# EAGLE design LilyPad-MP3-v15a (EAGLE 6.4)

## Sheet 1 of 2
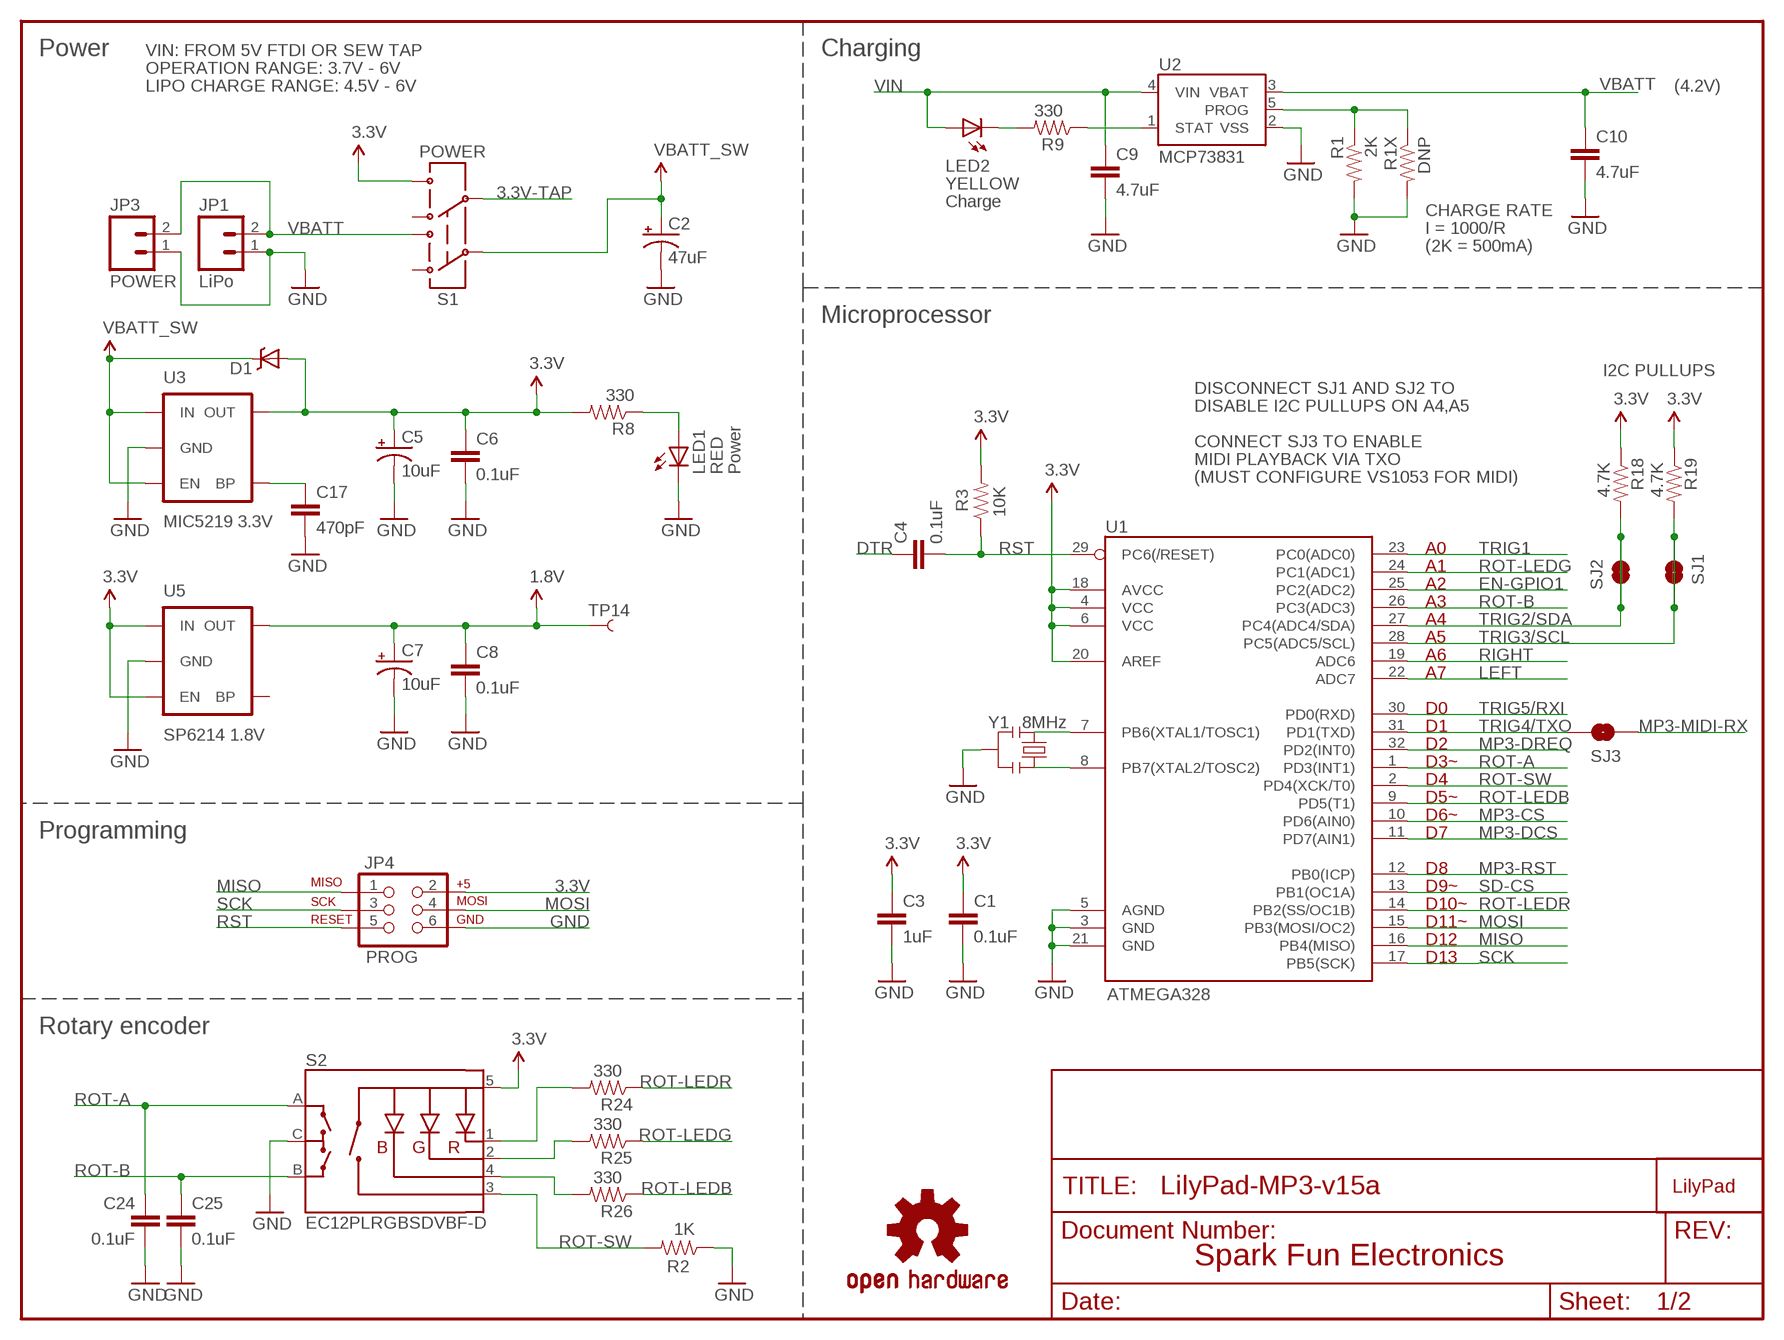
[diagram p0: schematic, sheet 1]

### Parts
C1  0.1uF  CAP0402-CAP  [0402-CAP]
C2  47uF  CAP_POL3528  [EIA3528]
C3  1uF  CAP0402-CAP  [0402-CAP]
C4  0.1uF  CAP0402-CAP  [0402-CAP]
C5  10uF  CAP_POL1206  [EIA3216]
C6  0.1uF  CAP0402-CAP  [0402-CAP]
C7  10uF  CAP_POL1206  [EIA3216]
C8  0.1uF  CAP0402-CAP  [0402-CAP]
C9  4.7uF  CAP0402-CAP  [0402-CAP]
C10  4.7uF  CAP0402-CAP  [0402-CAP]
C17  470pF  CAP0402-CAP  [0402-CAP]
C24  0.1uF  CAP0402-CAP  [0402-CAP]
C25  0.1uF  CAP0402-CAP  [0402-CAP]
D1  DIODE-SCHOTTKY  [SOD-523]
JP1  LiPo  M02-JST-2MM-SMT  [JST-2-SMD]
JP3  POWER  M02PTH  [1X02]
JP4  PROG  AVR_SPI_PRG_6NS  [2X3-NS]
LED1  RED  LED0603  [LED-0603]
LED2  YELLOW  LED0603  [LED-0603]
R1  2K  RESISTOR0402-RES  [0402-RES]
R1X  DNP  RESISTORAXIAL-0.3  [AXIAL-0.3]
R2  1K  RESISTOR0402-RES  [0402-RES]
R3  10K  RESISTOR0402-RES  [0402-RES]
R8  330  RESISTOR0402-RES  [0402-RES]
R9  330  RESISTOR0402-RES  [0402-RES]
R18  4.7K  RESISTOR0402-RES  [0402-RES]
R19  4.7K  RESISTOR0402-RES  [0402-RES]
R24  330  RESISTOR0402-RES  [0402-RES]
R25  330  RESISTOR0402-RES  [0402-RES]
R26  330  RESISTOR0402-RES  [0402-RES]
S1  POWER  AYZ0202  [AYZ0202]
S2  EC12PLRGBSDVBF-D  ENCODER_3LED_CA  [ENCODER_LED_3]
SJ1  SOLDERJUMPERNO  [SJ_2S-NO]
SJ2  SOLDERJUMPERNO  [SJ_2S-NO]
SJ3  SOLDERJUMPERNO  [SJ_2S-NO]
TP14  1.8V  TEST-POINT3X5  [PAD.03X.05]
U1  ATMEGA328  ATMEGA168  [TQFP32-08]
U2  MCP73831  [SOT23-5]
U3  MIC5219 3.3V  V_REG_LDOSMD  [SOT23-5]
U5  SP6214 1.8V  V_REG_LDOSMD2  [SC70]
U$1  LOGO-LPLP  [LOGO-LILYPAD]
U$4  OSHW-LOGOM  [OSHW-LOGO-M]
Y1  8MHz  RESONATORSMD  [RESONATOR-SMD]

### Nets
1.8V: C7.A(+) C8.1 TP14.P$1 U5.5(OUT) ; also sheet 2
3.3V: C1.1 C3.1 C5.A(+) C6.1 D1.A JP4.2 R3.2 R8.2 R18.1 R19.1 S1.4 S2.5(+) U1.4(VCC) U1.6(VCC) U1.18(AVCC) U1.20(AREF) U3.5(OUT) U5.1(IN) U5.3(EN) ; also sheet 2
3.3V-TAP: S1.5 ; also sheet 2
DTR: C4.1 ; also sheet 2
EN-GPIO1: U1.25(PC2(ADC2)) ; also sheet 2
GND [VCC]: C1.2 C2.C(-) C3.2 C5.C(-) C6.2 C7.C(-) C8.2 C9.2 C10.2 C17.2 C24.2 C25.2 JP1.1 JP3.1 JP4.6 LED1.C R1.2 R1X.P$2 R2.1 S2.C U1.3(GND) U1.5(AGND) U1.21(GND) U2.2(VSS) U3.2(GND) U5.2(GND) Y1.2 ; also sheet 2
LEFT: U1.22(ADC7) ; also sheet 2
MISO: JP4.1 U1.16(PB4(MISO)) ; also sheet 2
MOSI: JP4.4 U1.15(PB3(MOSI/OC2)) ; also sheet 2
MP3-CS: U1.10(PD6(AIN0)) ; also sheet 2
MP3-DCS: U1.11(PD7(AIN1)) ; also sheet 2
MP3-DREQ: U1.32(PD2(INT0)) ; also sheet 2
MP3-MIDI-RX: SJ3.1 ; also sheet 2
MP3-RST: U1.12(PB0(ICP)) ; also sheet 2
N$1: U1.7(PB6(XTAL1/TOSC1)) Y1.1
N$3: U1.8(PB7(XTAL2/TOSC2)) Y1.3
N$6: LED1.A R8.1
N$8: LED2.C R9.2
N$12: R24.2 S2.1(-R)
N$13: R25.2 S2.2(-G)
N$14: R26.2 S2.4(-B)
N$70: C17.1 U3.4(BP)
PROG: R1.1 R1X.P$1 U2.5(PROG)
RIGHT: U1.19(ADC6) ; also sheet 2
ROT-A: C24.1 S2.A U1.1(PD3(INT1))
ROT-B: C25.1 S2.B U1.26(PC3(ADC3))
ROT-LEDB: R26.1 U1.9(PD5(T1))
ROT-LEDG: R25.1 U1.24(PC1(ADC1))
ROT-LEDR: R24.1 U1.14(PB2(SS/OC1B))
ROT-SW: R2.2 S2.3(SW) U1.2(PD4(XCK/T0))
RST: C4.2 JP4.5 R3.1 U1.29(PC6(/RESET))
SCK: JP4.3 U1.17(PB5(SCK)) ; also sheet 2
SD-CS: U1.13(PB1(OC1A)) ; also sheet 2
STAT: R9.1 U2.1(STAT)
TRIG1: U1.23(PC0(ADC0)) ; also sheet 2
TRIG2/SDA: R18.2 SJ2.1 SJ2.2 U1.27(PC4(ADC4/SDA)) ; also sheet 2
TRIG3/SCL: R19.2 SJ1.1 SJ1.2 U1.28(PC5(ADC5/SCL)) ; also sheet 2
TRIG4/TXO: SJ3.2 U1.31(PD1(TXD)) ; also sheet 2
TRIG5/RXI: U1.30(PD0(RXD)) ; also sheet 2
VBATT: C10.1 JP1.2 JP3.2 S1.1 U2.3(VBAT)
VBATT_SW: C2.A(+) D1.C S1.2 U3.1(IN) U3.3(EN) ; also sheet 2
VIN: C9.1 LED2.A U2.4(VIN) ; also sheet 2
Unconnected: S1.3 S1.6 U5.4(BP)

### Notes on the sheet
- Power | VIN: FROM 5V FTDI OR SEW TAP | Charging
- OPERATION RANGE: 3.7V - 6V
- LIPO CHARGE RANGE: 4.5V - 6V | (4.2V)
- Charge
- CHARGE RATE
- I = 1000/R
- (2K = 500mA)
- Microprocessor
- I2C PULLUPS
- DISCONNECT SJ1 AND SJ2 TO
- DISABLE I2C PULLUPS ON A4,A5
- CONNECT SJ3 TO ENABLE
- MIDI PLAYBACK VIA TXO
- Power
- (MUST CONFIGURE VS1053 FOR MIDI)
- A0
- A1
- A2
- A3
- A4
- A5
- A6
- A7
- D0
- D1
- D2
- D3~
- D4
- D5~
- D6~
- Programming | D7
- D8
- D9~
- D10~
- D11~
- D12
- D13
- Rotary encoder
- Spark Fun Electronics

## Sheet 2 of 2
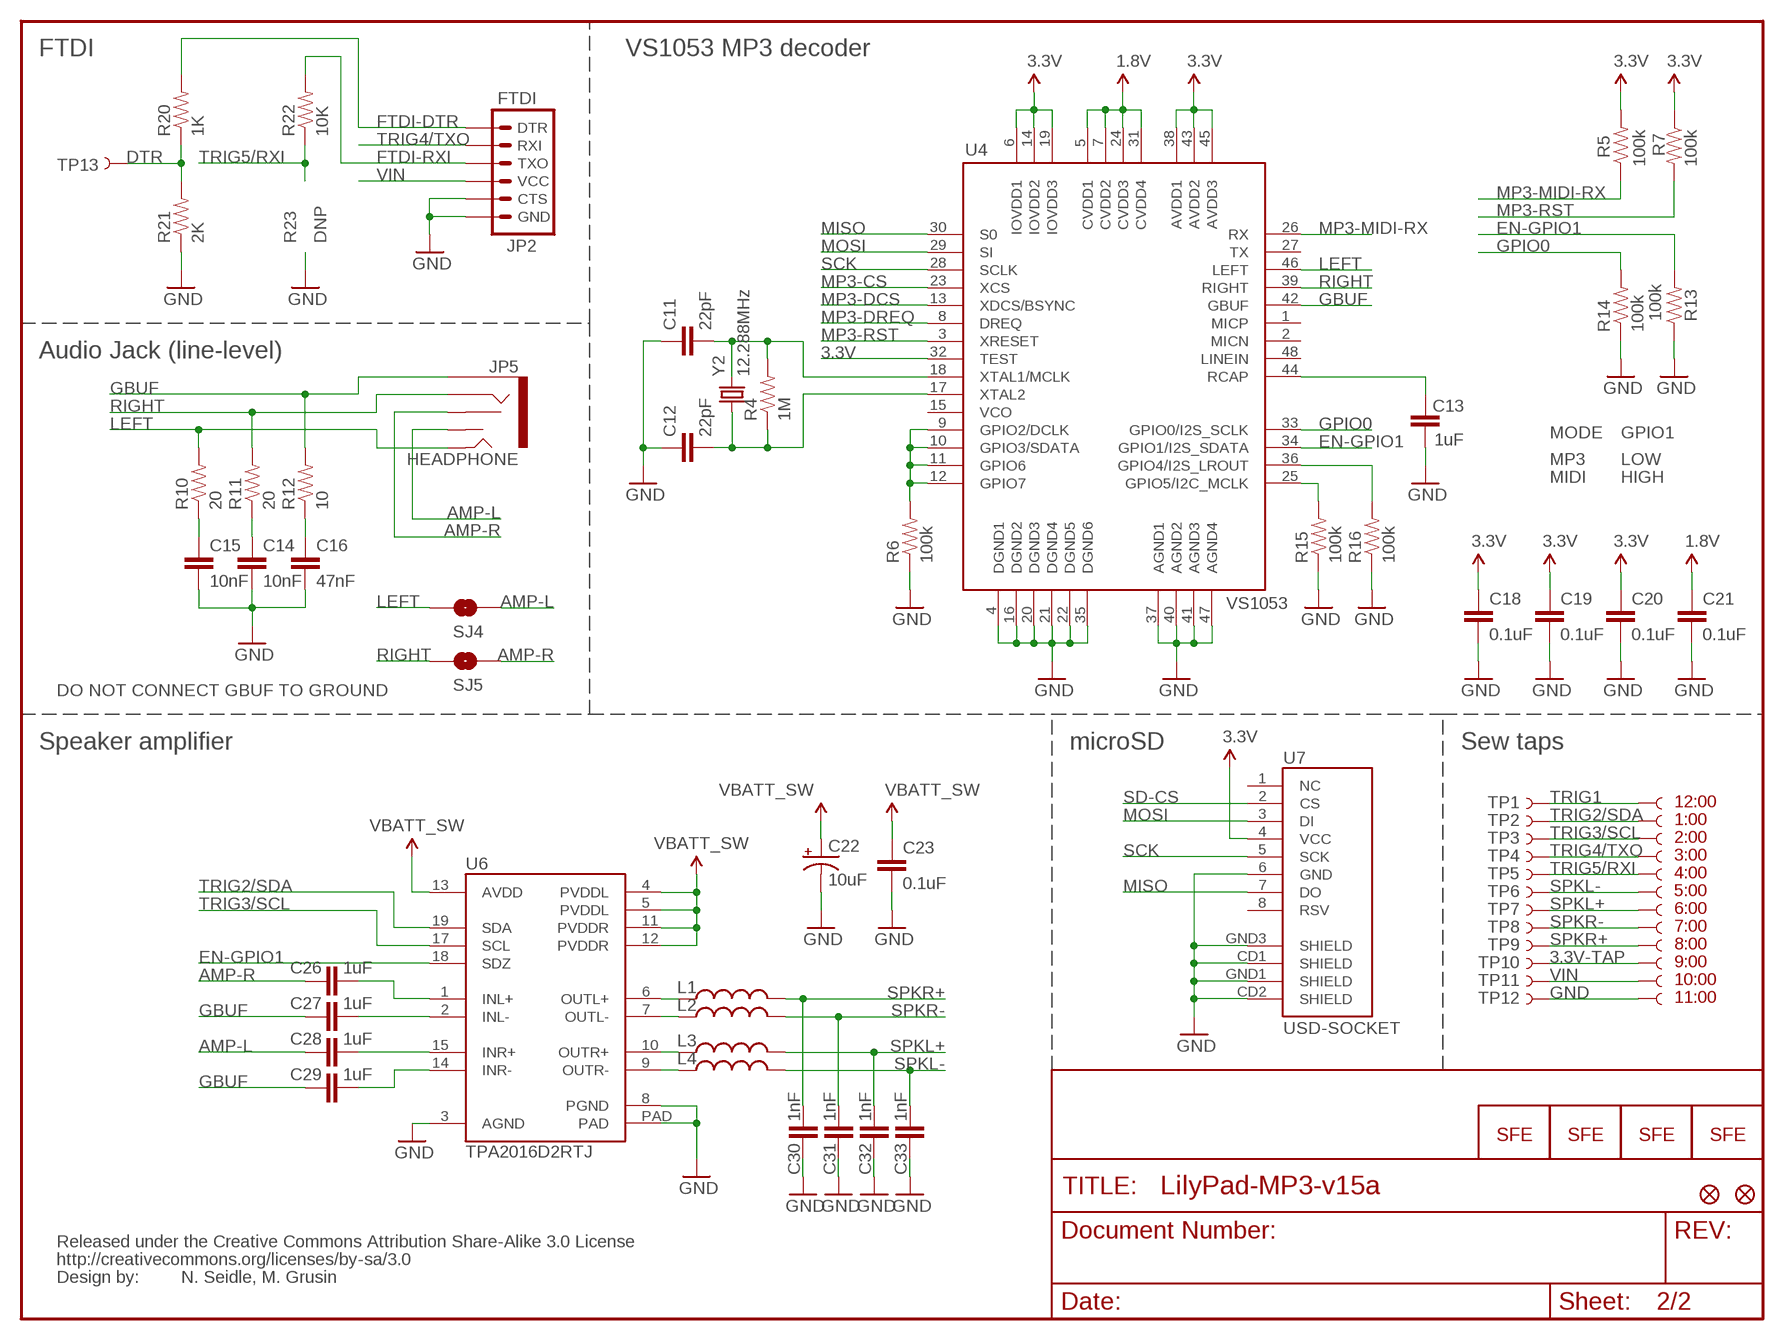
[diagram p1: schematic, sheet 2]

### Parts
C11  22pF  CAP0402-CAP  [0402-CAP]
C12  22pF  CAP0402-CAP  [0402-CAP]
C13  1uF  CAP0402-CAP  [0402-CAP]
C14  10nF  CAP0402-CAP  [0402-CAP]
C15  10nF  CAP0402-CAP  [0402-CAP]
C16  47nF  CAP0402-CAP  [0402-CAP]
C18  0.1uF  CAP0402-CAP  [0402-CAP]
C19  0.1uF  CAP0402-CAP  [0402-CAP]
C20  0.1uF  CAP0402-CAP  [0402-CAP]
C21  0.1uF  CAP0402-CAP  [0402-CAP]
C22  10uF  CAP_POL1206  [EIA3216]
C23  0.1uF  CAP0402-CAP  [0402-CAP]
C26  1uF  CAP0402-CAP  [0402-CAP]
C27  1uF  CAP0402-CAP  [0402-CAP]
C28  1uF  CAP0402-CAP  [0402-CAP]
C29  1uF  CAP0402-CAP  [0402-CAP]
C30  1nF  CAP0402-CAP  [0402-CAP]
C31  1nF  CAP0402-CAP  [0402-CAP]
C32  1nF  CAP0402-CAP  [0402-CAP]
C33  1nF  CAP0402-CAP  [0402-CAP]
JP2  FTDI  ARDUINO_SERIAL_PROGRAMSMD  [1X06-SMD]
JP5  HEADPHONE  AUDIO-JACK2SMD  [AUDIO-JACK-3.5MM-SMD]
JP6  LOGO-SFENW2  [SFE-NEW-WEB]
JP7  FIDUCIALUFIDUCIAL  [MICRO-FIDUCIAL]
JP8  FIDUCIALUFIDUCIAL  [MICRO-FIDUCIAL]
L1  INDUCTOR0805  [0805]
L2  INDUCTOR0805  [0805]
L3  INDUCTOR0805  [0805]
L4  INDUCTOR0805  [0805]
LOGO1  LOGO-SFESK  [SFE-LOGO-FLAME]
LOGO2  LOGO-SFENEW  [SFE-NEW-WEBLOGO]
LOGO3  LOGO-SFESK  [SFE-LOGO-FLAME]
R4  1M  RESISTOR0402-RES  [0402-RES]
R5  100k  RESISTOR0402-RES  [0402-RES]
R6  100k  RESISTOR0402-RES  [0402-RES]
R7  100k  RESISTOR0402-RES  [0402-RES]
R10  20  RESISTOR0402-RES  [0402-RES]
R11  20  RESISTOR0402-RES  [0402-RES]
R12  10  RESISTOR0402-RES  [0402-RES]
R13  100k  RESISTOR0402-RES  [0402-RES]
R14  100k  RESISTOR0402-RES  [0402-RES]
R15  100k  RESISTOR0402-RES  [0402-RES]
R16  100k  RESISTOR0402-RES  [0402-RES]
R20  1K  RESISTOR0402-RES  [0402-RES]
R21  2K  RESISTOR0402-RES  [0402-RES]
R22  10K  RESISTOR0402-RES  [0402-RES]
SJ4  SOLDERJUMPERNO  [SJ_2S-NO]
SJ5  SOLDERJUMPERNO  [SJ_2S-NO]
ST1  TRIG2/SDA  SEWTAP9  [PETAL-LONG-1-2SIDE]
ST2  TRIG3/SCL  SEWTAP9  [PETAL-LONG-1-2SIDE]
ST3  TRIG4/TXO  SEWTAP9  [PETAL-LONG-1-2SIDE]
ST4  TRIG5/RXI  SEWTAP9  [PETAL-LONG-1-2SIDE]
ST5  SPKL-  SEWTAP9  [PETAL-LONG-1-2SIDE]
ST6  SPKL+  SEWTAP9  [PETAL-LONG-1-2SIDE]
ST7  SPKR-  SEWTAP9  [PETAL-LONG-1-2SIDE]
ST8  SPKR+  SEWTAP9  [PETAL-LONG-1-2SIDE]
ST9  3.3V  SEWTAP9  [PETAL-LONG-1-2SIDE]
ST10  VIN  SEWTAP9  [PETAL-LONG-1-2SIDE]
ST11  GND  SEWTAP9  [PETAL-LONG-1-2SIDE]
ST12  TRIG1  SEWTAP9  [PETAL-LONG-1-2SIDE]
TP1  TRIG1  TEST-POINT-PTH-LARGE  [1X01NS]
TP2  TRIG2/SDA  TEST-POINT-PTH-LARGE  [1X01NS]
TP3  TRIG3/SCL  TEST-POINT-PTH-LARGE  [1X01NS]
TP4  TRIG4/TXO  TEST-POINT-PTH-LARGE  [1X01NS]
TP5  TRIG5/RXI  TEST-POINT-PTH-LARGE  [1X01NS]
TP6  SPKL-  TEST-POINT-PTH-LARGE  [1X01NS]
TP7  SPKL+  TEST-POINT-PTH-LARGE  [1X01NS]
TP8  SPKR-  TEST-POINT-PTH-LARGE  [1X01NS]
TP9  SPKR+  TEST-POINT-PTH-LARGE  [1X01NS]
TP10  3.3V  TEST-POINT-PTH-LARGE  [1X01NS]
TP11  VIN  TEST-POINT-PTH-LARGE  [1X01NS]
TP12  GND  TEST-POINT-PTH-LARGE  [1X01NS]
TP13  DTR  TEST-POINT3X5  [PAD.03X.05]
U4  VS1053  VS1033  [LQFP-48]
U6  TPA2016D2RTJ  [QFN-20-0.5MM]
U7  USD-SOCKET  USD-SOCKETNEW  [MICRO-SD-SOCKET-PP]
U$12  CREATIVE_COMMONS  [CREATIVE_COMMONS]
Y2  12.288MHz  CRYSTAL5X3  [CRYSTAL-SMD-5X3]

### Nets
1.8V: C21.1 U4.5(CVDD1) U4.7(CVDD2) U4.24(CVDD3) U4.31(CVDD4) ; also sheet 1
3.3V: C18.1 C19.1 C20.1 R5.2 R7.1 U4.6(IOVDD1) U4.14(IOVDD2) U4.19(IOVDD3) U4.32(TEST) U4.38(AVDD1) U4.43(AVDD2) U4.45(AVDD3) U7.4(VCC) ; also sheet 1
3.3V-TAP: ST9.1 TP10.1 ; also sheet 1
AMP-L: C28.1 JP5.TSH SJ4.1
AMP-LX: C26.2 U6.1(INL+)
AMP-R: C26.1 JP5.RSH SJ5.1
AMP-RX: C28.2 U6.15(INR+)
DTR: R20.1 R21.2 TP13.P$1 ; also sheet 1
EN-GPIO1: R13.2 U4.34(GPIO1/I2S_SDATA) U6.18(SDZ) ; also sheet 1
FTDI-DTR: JP2.1(DTR) R20.2
FTDI-RXI: JP2.3(TXO) R22.2
G1: R6.2 U4.9(GPIO2/DCLK) U4.10(GPIO3/SDATA) U4.11(GPIO6) U4.12(GPIO7)
G2: R15.2 U4.25(GPIO5/I2C_MCLK)
GBUF: C27.1 C29.1 JP5.SLEEVE R12.2 U4.42(GBUF)
GBUFLX: C27.2 U6.2(INL-)
GBUFRX: C29.2 U6.14(INR-)
GND [VCC]: C11.1 C12.1 C13.1 C14.2 C15.2 C16.2 C18.2 C19.2 C20.2 C21.2 C22.C(-) C23.2 C30.2 C31.2 C32.2 C33.2 JP2.5(CTS) JP2.6(GND) R6.1 R13.1 R14.1 R15.1 R16.1 R21.1 ST11.1 TP12.1 U4.4(DGND1) U4.16(DGND2) U4.20(DGND3) U4.21(DGND4) U4.22(DGND5) U4.35(DGND6) U4.37(AGND1) U4.40(AGND2) U4.41(AGND3) U4.47(AGND4) U6.3(AGND) U6.8(PGND) U6.PAD U7.6(GND) U7.CD1(SHIELD) U7.CD2(SHIELD) U7.GND1(SHIELD) U7.GND3(SHIELD) ; also sheet 1
GPIO0: R14.2 U4.33(GPIO0/I2S_SCLK)
LEFT: JP5.TIP R10.2 SJ4.2 U4.46(LEFT) ; also sheet 1
MISO: U4.30(S0) U7.7(DO) ; also sheet 1
MOSI: U4.29(SI) U7.3(DI) ; also sheet 1
MP3-CS: U4.23(XCS) ; also sheet 1
MP3-DCS: U4.13(XDCS/BSYNC) ; also sheet 1
MP3-DREQ: U4.8(DREQ) ; also sheet 1
MP3-MIDI-RX: R5.1 U4.26(RX) ; also sheet 1
MP3-RST: R7.2 U4.3(XRESET) ; also sheet 1
N$4: C13.2 U4.44(RCAP)
N$5: C16.1 R12.1
N$7: C15.1 R10.1
N$9: C11.2 R4.2 U4.18(XTAL1/MCLK) Y2.3
N$10: C12.2 R4.1 U4.17(XTAL2) Y2.1
N$11: C14.1 R11.1
N$16: L1.1 U6.6(OUTL+)
N$17: L2.1 U6.7(OUTL-)
N$18: L3.1 U6.10(OUTR+)
N$19: L4.1 U6.9(OUTR-)
N$73: R16.2 U4.36(GPIO4/I2S_LROUT)
RIGHT: JP5.RING R11.2 SJ5.2 U4.39(RIGHT) ; also sheet 1
SCK: U4.28(SCLK) U7.5(SCK) ; also sheet 1
SD-CS: U7.2(CS) ; also sheet 1
SPKL+: C32.1 L3.2 ST6.1 TP7.1
SPKL-: C33.1 L4.2 ST5.1 TP6.1
SPKR+: C30.1 L1.2 ST8.1 TP9.1
SPKR-: C31.1 L2.2 ST7.1 TP8.1
TRIG1: ST12.1 TP1.1 ; also sheet 1
TRIG2/SDA: ST1.1 TP2.1 U6.19(SDA) ; also sheet 1
TRIG3/SCL: ST2.1 TP3.1 U6.17(SCL) ; also sheet 1
TRIG4/TXO: JP2.2(RXI) ST3.1 TP4.1 ; also sheet 1
TRIG5/RXI: R22.1 ST4.1 TP5.1 ; also sheet 1
VBATT_SW: C22.A(+) C23.1 U6.4(PVDDL) U6.5(PVDDL) U6.11(PVDDR) U6.12(PVDDR) U6.13(AVDD) ; also sheet 1
VIN: JP2.4(VCC) ST10.1 TP11.1 ; also sheet 1
Unconnected: U4.1(MICP) U4.2(MICN) U4.15(VCO) U4.27(TX) U4.48(LINEIN) U7.1(NC) U7.8(RSV)

### Notes on the sheet
- FTDI | VS1053 MP3 decoder
- R23 | DNP
- Audio Jack (line-level)
- MODE | GPIO1
- MP3 | LOW
- MIDI | HIGH
- DO NOT CONNECT GBUF TO GROUND
- Speaker amplifier | microSD | Sew taps
- 12:00
- 1:00
- 2:00
- 3:00
- 4:00
- 5:00
- 6:00
- 7:00
- 8:00
- 9:00
- 10:00
- 11:00
- N. Seidle, M. Grusin

## Library data of the parts
C1 C3 C4 C6 C8-C21 C23-C29 = SparkFun:CAP: Capacitor Standard 0603 ceramic capacitor, and 0.1" leaded capacitor.
C2 C5 C7 C22 = SparkFun:CAP_POL: Capacitor Polarized These are standard SMD and PTH capacitors. Normally 10uF, 47uF, and 100uF in electrolytic and tantalum varieties. Always verify the external diameter of the through hole cap, it varies with capacity, voltage, and manufacturer. The EIA devices should be standard.
C30-C33 = SparkFun-Passives:CAP: Capacitor Standard 0603 ceramic capacitor, and 0.1" leaded capacitor.
D1 = SparkFun-DiscreteSemi:DIODE-SCHOTTKY: Commonly MBRA140.
JP1 JP3 = SparkFun:M02: Header 2 Standard 2-pin 0.1" header. Use with straight break away headers (SKU : PRT-00116), right angle break away headers (PRT-00553), swiss pins (PRT-00743), machine pins (PRT-00117), and female headers (PRT-00115). Molex polarized connector foot print use with SKU : PRT-08233 with associated crimp pins and housings.
JP2 = SparkFun:ARDUINO_SERIAL_PROGRAM
JP4 = SparkFun:AVR_SPI_PRG_6: AVR ISP 6 Pin This is the reduced ISP connector for AVR programming. Common on Arduino. This footprint will take up less PCB space and can be used with a 10-pin to 6-pin adapter such as SKU: BOB-08508
JP5 = SparkFun:AUDIO-JACK2
JP6 LOGO1-LOGO3 = SparkFun:LOGO-SFE: Spark Fun Electronics PCB Logo This is the standard Spark Fun Electronics PCB logo.
JP7 JP8 = SparkFun-Aesthetics:FIDUCIAL: Fiducial Alignment Points Various fiducial points for machine vision alignment.
L1-L4 = SparkFun-Passives:INDUCTOR: Inductors Basic Inductor/Choke - 0603 and 1206. Footprints are not proven and vary greatly between part numbers.
LED1 LED2 = SparkFun:LED: LEDs Standard schematic elements and footprints for 5mm, 3mm, 1206, and 0603 sized LEDs. 5mm - Spark Fun Electronics SKU : COM-00529 (and others)
R1 R1X R2-R16 R18-R22 R24-R26 = SparkFun:RESISTOR: Resistor Basic schematic elements and footprints for 0603, 1206, and PTH resistors.
S1 = SparkFun:AYZ0202: SPDT Slide Switch Simple SMD single-pull double-throw slide switch. Good for less than 350mA power switch, switching UARTs between devices, etc. Spark Fun Electronics SKU : COM-00597
S2 = mike-temp:ENCODER_3LED_CA
SJ1-SJ5 = SparkFun:SOLDERJUMPER: Solder Jumper Standard SMD solder jumper. Used to automate production. Two varients : Normally Open and Normally Closed are the same, but have different paste layers. NC will have a large amount of paste and should jumper during reflow.
ST1-ST12 = LilyPad-Wearables:SEWTAP
TP1-TP12 = mike-temp:TEST-POINT
TP13 TP14 = SparkFun:TEST-POINT
U1 = SparkFun:ATMEGA168
U2 = SparkFun:MCP73831: Microchip's MCP73831 Miniature single cell, fully integrated Li-Ion, Li-polymer charge management controller http://ww1.microchip.com/downloads/en/DeviceDoc/21984a.pdf
U3 U5 = SparkFun:V_REG_LDO: Voltage Regulator LDO Standard 150mA LDO voltage regulator in SOT-23 layout. Micrel part MIC5205. BP (by-pass) pin is used to lower output noise with 470pF cap.
U4 = SparkFun:VS1033
U6 = mike-temp:TPA2016D2: 2.8-W/Ch Stereo Class-D Audio Amplifier with I2C volume control, DRC and AGC The TPA2016D2 is a stereo, filter-free Class-D audio power amplifier with volume control, dynamic range compression (DRC) and automatic gain control (AGC). It is available in a 2.2 mm x 2.2 mm WCSP package and 20-pin QFN package. The DRC/AGC function in the TPA2016D2 is programmable via a digital I2C interface. The DRC/AGC function can be configured to automatically prevent distortion of the audio signal and enhance quiet passages that are normally not heard. The DRC/AGC can also be configured to protect the speaker from damage at high power levels and compress the dynamic range of music to fit within the dynamic range of the speaker. The gain can be selected from ?28 dB to +30 dB in 1-dB steps. The TPA2016D2 is capable of driving 1.7 W/Ch at 5 V or750 mW/Ch at 3.6 V into 8 ? load or 2.8 W/Ch at 5 V or 1.5 W/Ch at 3.6 V into 4 ? load. The device features independent software shutdown controls for each channel and also provides thermal and short circuit protection. In addition to these features, a fast start-up time and small package size make the TPA2016D2 an ideal choice for cellular handsets, PDAs and other portable applications. · 1.7 W/Ch Into 8 ? at 5 V (10% THD+N) · 750 mW/Ch Into 8 ? at 3.6 V (10% THD+N) · 2.8 W/Ch Into 4 ? at 5 V (10% THD+N) · 1.5 W/Ch Into 4 ? at 3.6 V (10% THD+N) · Power Supply Range: 2.5 V to 5.5 V · Flexible Operation With/Without I2C · Programmable DRC/AGC Parameters · Digital I2C Volume Control · Selectable Gain from ?28 dB to 30 dB in 1-dB Steps (when compression is used) · Selectable Attack, Release and Hold Times · 4 Selectable Compression Ratios · Low Supply Current: 3.5 mA · Low Shutdown Current: 0.2 mA · High PSRR: 80 dB · Fast Start-up Time: 5 ms circuit protection. · AGC Enable/Disable Function · Limiter Enable/Disable Function · Short-Circuit and Thermal Protection
U7 = SparkFun:USD-SOCKET: microSD Socket Push-push type uSD socket. Schematic element and footprint production proven. Spark Fun Electronics SKU : PRT-00127. tDoc lines correctly indicate media card edge positions when inserting (unlocked, locked, depressed).
U$1 = LilyPad-Wearables:LOGO-LP
U$4 = SparkFun:OSHW-LOGO: Open Source Hardware Logo This logo indicates the piece of hardware it is found on incorporates a OSHW license and/or adheres to the definition of open source hardware found here: http://freedomdefined.org/OSHW
U$12 = SparkFun:CREATIVE_COMMONS
Y1 = SparkFun:RESONATOR: Resonator Small SMD resonator. This is the itty bitty 10/20MHz resonators with built in caps. CSTCE10M0G55 and CSTCE20M0V53. Footprint has been reviewed closely but hasn't been tested yet.
Y2 = SparkFun:CRYSTAL: Crystals Various standard crystals. Proven footprints. Spark Fun Electronics SKU : COM-00534

## Net classes
0 default: clearance 0.254 mm
1 VCC: width 0.254 mm, clearance 0.254 mm

## Board
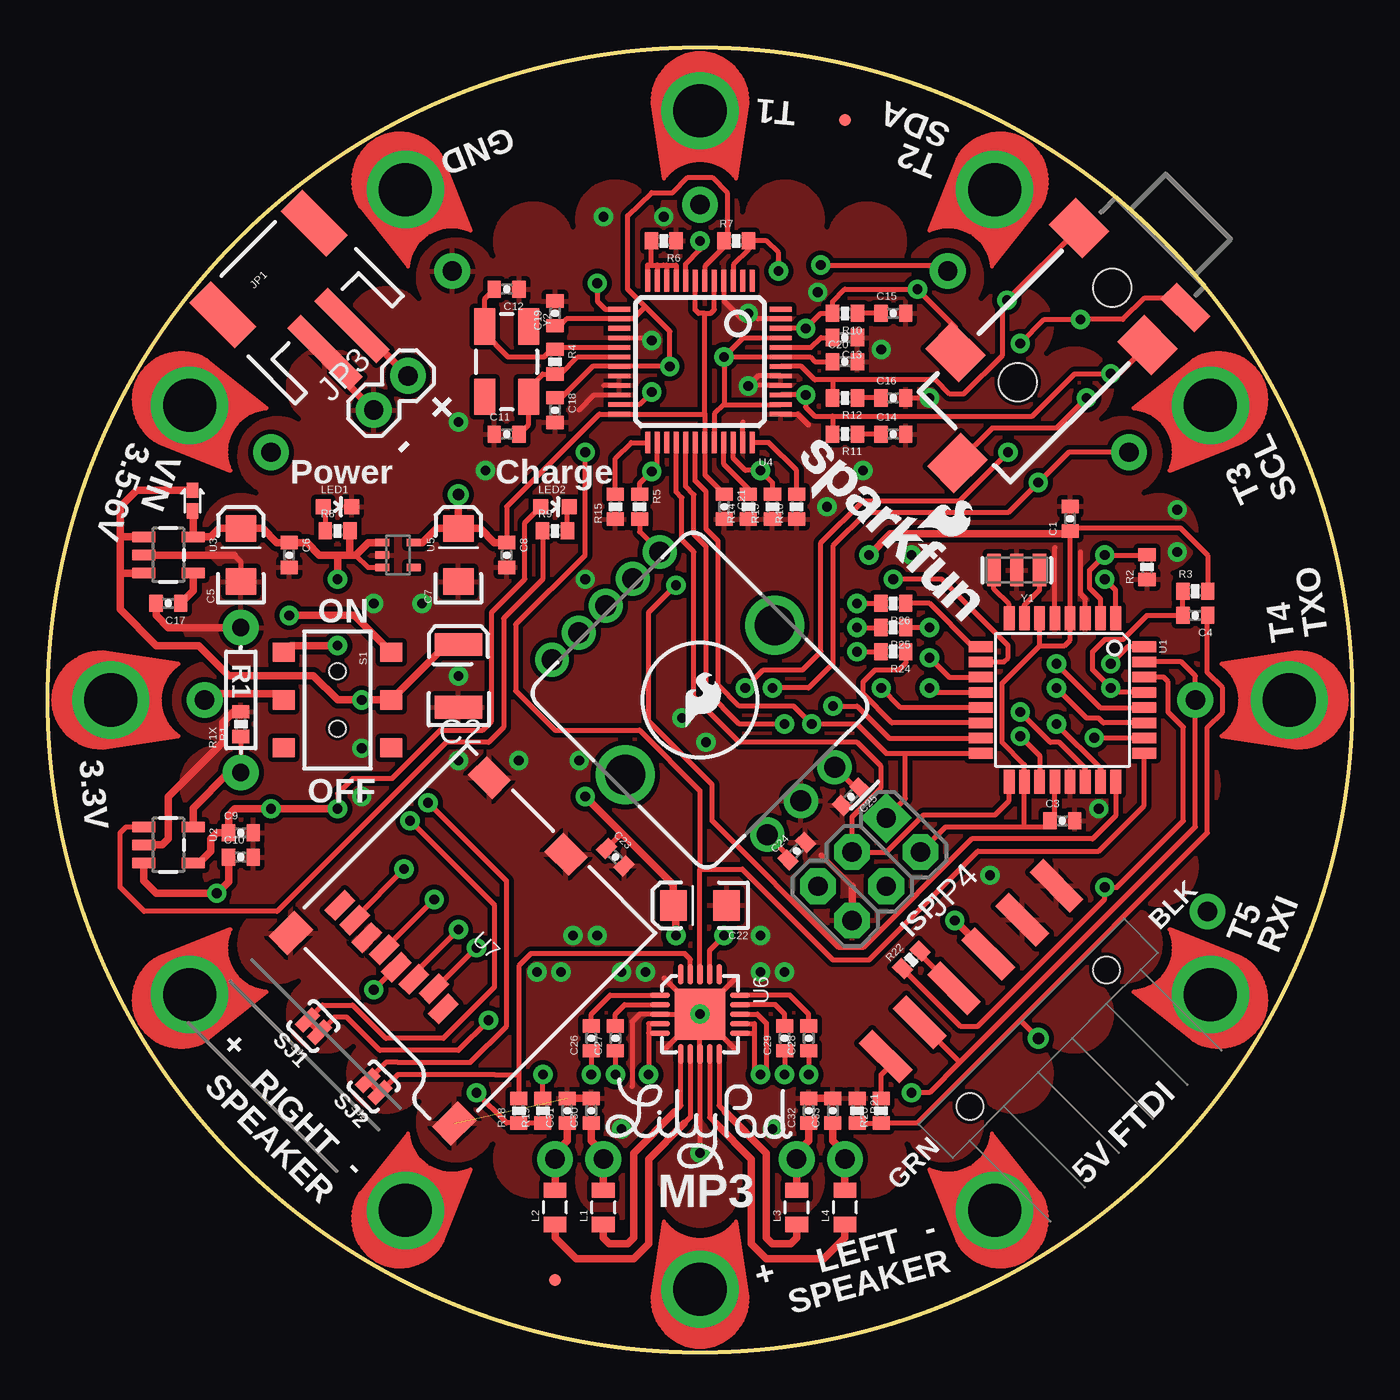
[diagram p2: board, top side]
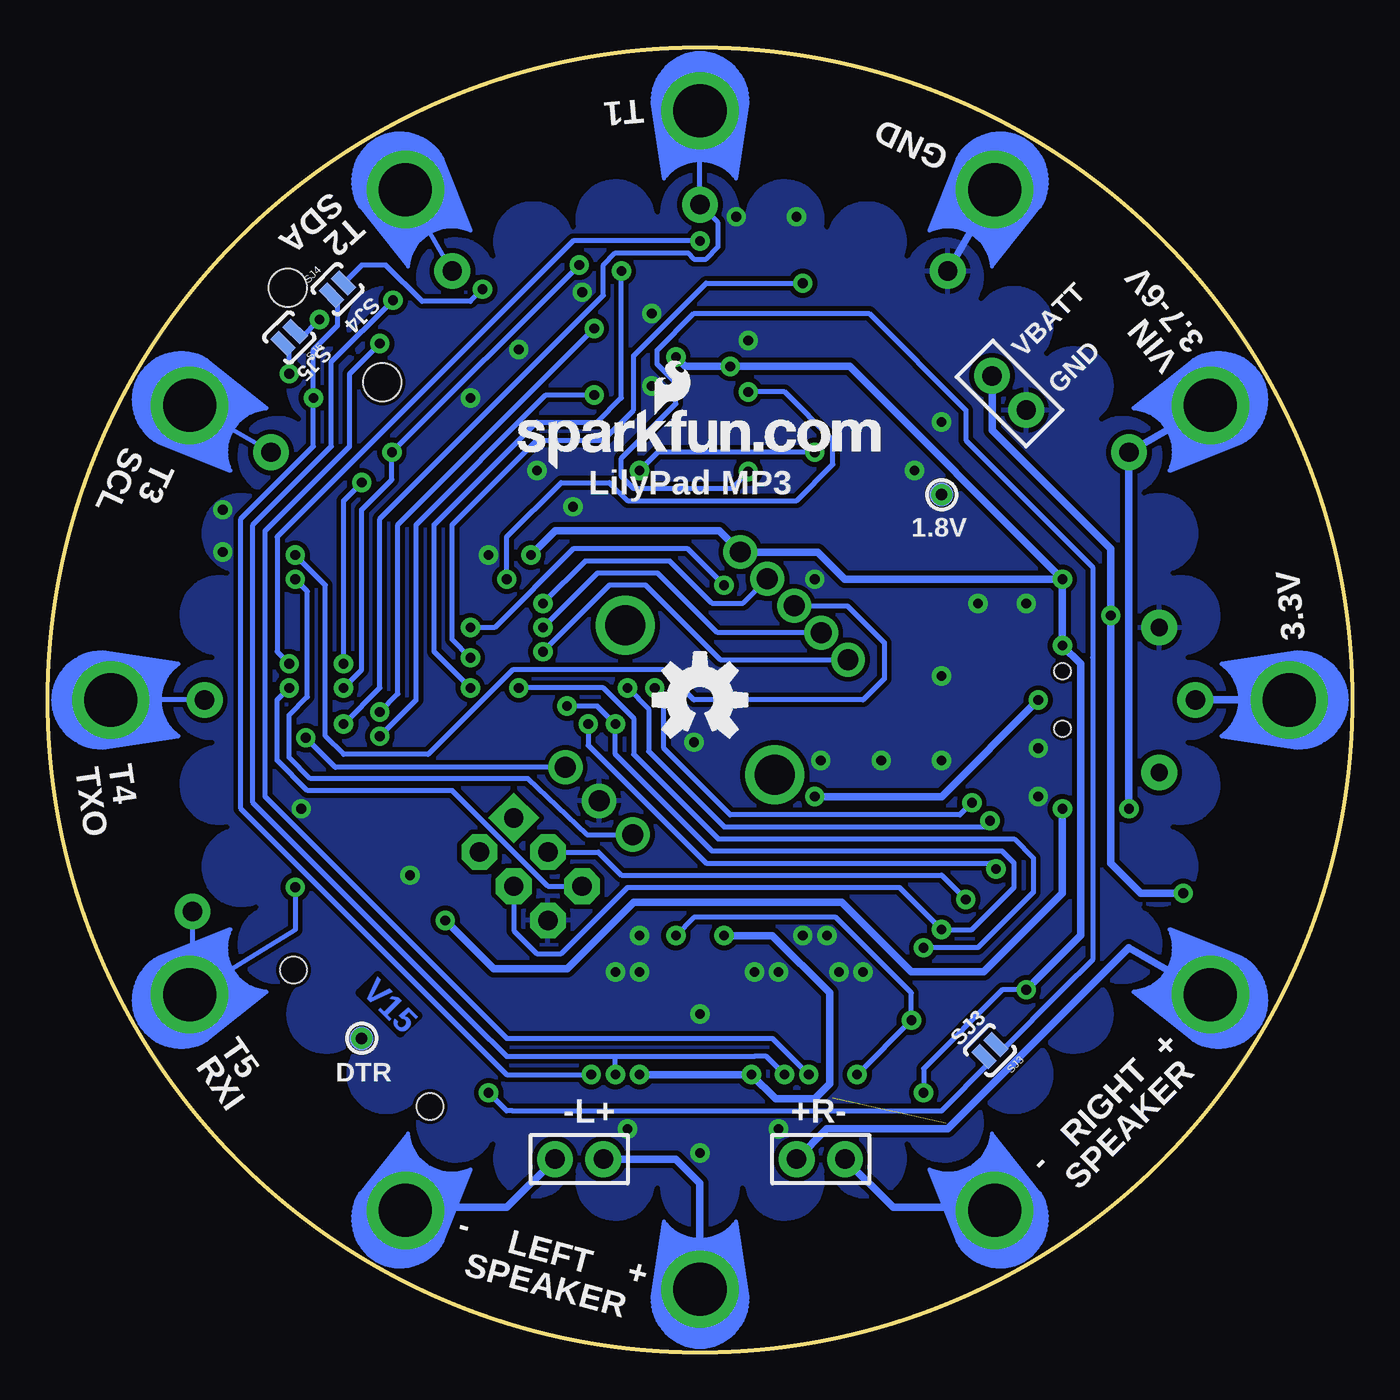
[diagram p3: board, bottom side, seen from below]

Size 68.58 x 68.58 mm. Coordinates in mm from the lower left corner, seen from the top.
Outline: circle at 34.29,34.29 radius 34.29
Copper layers (1*16): Top 0.035mm / dielectric 1.5mm / Bottom 0.035mm
Design rules: minimum track width 8mil, minimum drill 20mil, track to track 5mil, track to pad 5mil, pad to pad 5mil, via to via 5mil, smd to smd 5mil, copper to edge 8mil, drill to drill 8mil, minimum pad ring 12mil, minimum via ring 10mil, stop-mask expansion 4mil, vias tented up to drill 20mil, thermal gap 10mil
tRestrict: area 3.1,3.1 to 65.5,65.5; area 59.9,31.8 to 63.3,36.8; area 59.2,36.5 to 63.3,41.8; area 57.6,41 to 62.4,46.6; area 55.4,45.2 to 60.7,51; area 52.5,49.1 to 58.1,54.9; area 49.1,52.5 to 54.9,58.1; area 45.2,55.4 to 51,60.7; area 41,57.6 to 46.6,62.4; area 36.5,59.2 to 41.8,63.3; area 31.8,59.9 to 36.8,63.3; area 26.8,59.2 to 32,63.3; area 22,57.6 to 27.6,62.4; area 17.6,55.4 to 23.4,60.7; area 13.7,52.5 to 19.5,58.1; area 10.4,49.1 to 16.1,54.9; area 7.9,45.2 to 13.2,51; area 6.2,41 to 11,46.6; area 5.3,36.5 to 9.4,41.8; area 5.3,31.8 to 8.6,36.8; area 5.3,26.8 to 9.4,32; area 6.2,22 to 11,27.6; area 7.9,17.6 to 13.2,23.4; area 10.4,13.7 to 16.1,19.5; area 13.7,10.4 to 19.5,16.1; area 17.6,7.9 to 23.4,13.2; area 22,6.2 to 27.6,11; area 26.8,5.3 to 32,9.4; area 31.8,5.3 to 36.8,8.6; area 36.5,5.3 to 41.8,9.4; area 41,6.2 to 46.6,11; area 45.2,7.9 to 51,13.2; area 49.1,10.4 to 54.9,16.1; area 52.5,13.7 to 58.1,19.5; area 55.4,17.6 to 60.7,23.4; area 57.6,22 to 62.4,27.6; area 59.2,26.8 to 63.3,32
bRestrict: area 3.1,3.1 to 65.5,65.5; area 59.9,31.8 to 63.3,36.8; area 59.2,36.5 to 63.3,41.8; area 57.6,41 to 62.4,46.6; area 55.4,45.2 to 60.7,51; area 52.5,49.1 to 58.1,54.9; area 49.1,52.5 to 54.9,58.1; area 45.2,55.4 to 51,60.7; area 41,57.6 to 46.6,62.4; area 36.5,59.2 to 41.8,63.3; area 31.8,59.9 to 36.8,63.3; area 26.8,59.2 to 32,63.3; area 22,57.6 to 27.6,62.4; area 17.6,55.4 to 23.4,60.7; area 13.7,52.5 to 19.5,58.1; area 10.4,49.1 to 16.1,54.9; area 7.9,45.2 to 13.2,51; area 6.2,41 to 11,46.6; area 5.3,36.5 to 9.4,41.8; area 5.3,31.8 to 8.6,36.8; area 5.3,26.8 to 9.4,32; area 6.2,22 to 11,27.6; area 7.9,17.6 to 13.2,23.4; area 10.4,13.7 to 16.1,19.5; area 13.7,10.4 to 19.5,16.1; area 17.6,7.9 to 23.4,13.2; area 22,6.2 to 27.6,11; area 26.8,5.3 to 32,9.4; area 31.8,5.3 to 36.8,8.6; area 36.5,5.3 to 41.8,9.4; area 41,6.2 to 46.6,11; area 45.2,7.9 to 51,13.2; area 49.1,10.4 to 54.9,16.1; area 52.5,13.7 to 58.1,19.5; area 55.4,17.6 to 60.7,23.4; area 57.6,22 to 62.4,27.6; area 59.2,26.8 to 63.3,32

### Footprints (pad centres in the part's own frame; a part is rotated, then mirrored left to right if it is on the bottom)
0402-CAP = smd 0.7 x 0.9: 1 -0.65,0; 2 0.65,0
EIA3528 = smd 1.2 x 2.5: A 1.65,0; C -1.65,0
EIA3216 = smd 1.4 x 1.6: A 1.4,0; C -1.4,0
SOD-523 = smd 0.8 x 0.6: A -0.55,0; C 0.55,0
JST-2-SMD = smd 1 x 4.6: 1 -1,-3.7; 2 1,-3.7 | smd 1.6 x 3.4: NC1 -3.4,1.5; NC2 3.4,1.5
1X06-SMD = smd 1 x 3: 1 -6.35,5; 2 -3.81,5; 3 -1.27,5; 4 1.27,5; 5 3.81,5; 6 6.35,5 | hole 1.4: -5.08,0; 5.08,0
1X02 = drill 1.016 pad 1.88: 1 0,0; 2 2.54,0
2X3-NS = drill 1.016 pad 1.88 square: 1 -2.54,-1.27 | drill 1.016 pad 1.88 octagon: 2 -2.54,1.27; 3 0,-1.27; 4 0,1.27; 5 2.54,-1.27; 6 2.54,1.27
AUDIO-JACK-3.5MM-SMD = smd 2 x 2.5: RING 4.3,3.45; SLEEVE 2.5,-3.45; TIP 11.7,-3.45 | smd 1.2 x 2.5: RSH 1.5,3.45 | smd 2.5 x 2: TSH 15.75,0.75 | hole 2: 3.5,0; 10.5,0
MICRO-FIDUCIAL = smd 0.635 x 0.635: 1 0,0
0805 = smd 0.8 x 1.2: 1 -0.9,0; 2 0.9,0
LED-0603 = smd 0.8 x 0.8: A 0,-0.75; C 0,0.75
0402-RES = smd 0.7 x 0.9: 1 -0.65,0; 2 0.65,0
AXIAL-0.3 = drill 0.9 pad 1.88: P$1 -3.81,0; P$2 3.81,0
AYZ0202 = smd 1 x 1.15: 1 -2.5,2.825; 2 0,2.825; 3 2.5,2.825; 4 -2.5,-2.825; 5 0,-2.825; 6 2.5,-2.825 | hole 0.85: 1.5,0; -1.5,0
ENCODER_LED_3 = drill 1.1 pad 1.778: 1 -4,7; 2 -2,7; 3 0,7; 4 2,7; 5 4,7 | drill 1.1 pad 1.8: A -2.5,-7.5; B 2.5,-7.5; C 0,-7.5 | drill 2.1: M1 -5.55,0; M2 5.55,0
SJ_2S-NO = smd 0.635 x 1.27: 1 -0.45,0; 2 0.45,0
PETAL-LONG-1-2SIDE = drill 2.794 pad 4.064: 1 0.03,0
1X01NS = drill 1.016 pad 1.88: 1 0,0
PAD.03X.05 = smd 1.27 x 1.27: P$1 0,0
TQFP32-08 = smd 1.27 x 0.559: 1 -4.293,2.8; 2 -4.293,2; 3 -4.293,1.2; 4 -4.293,0.4; 5 -4.293,-0.4; 6 -4.293,-1.2; 7 -4.293,-2; 8 -4.293,-2.8; 17 4.293,-2.8; 18 4.293,-2; 19 4.293,-1.2; 20 4.293,-0.4; 21 4.293,0.4; 22 4.293,1.2; 23 4.293,2; 24 4.293,2.8 | smd 0.559 x 1.27: 9 -2.8,-4.293; 10 -2,-4.293; 11 -1.2,-4.293; 12 -0.4,-4.293; 13 0.4,-4.293; 14 1.2,-4.293; 15 2,-4.293; 16 2.8,-4.293; 25 2.8,4.293; 26 2,4.293; 27 1.2,4.293; 28 0.4,4.293; 29 -0.4,4.293; 30 -1.2,4.293; 31 -2,4.293; 32 -2.8,4.293
SOT23-5 = smd 0.55 x 1.2: 1 -0.95,-1.3; 2 0,-1.3; 3 0.95,-1.3; 4 0.95,1.3; 5 -0.95,1.3
LQFP-48 = smd 0.254 x 1.143: 1 -2.75,-4.25; 2 -2.25,-4.25; 3 -1.75,-4.25; 4 -1.25,-4.25; 5 -0.75,-4.25; 6 -0.25,-4.25; 7 0.25,-4.25; 8 0.75,-4.25; 9 1.25,-4.25; 10 1.75,-4.25; 11 2.25,-4.25; 12 2.75,-4.25; 25 2.75,4.25; 26 2.25,4.25; 27 1.75,4.25; 28 1.25,4.25; 29 0.75,4.25; 30 0.25,4.25; 31 -0.25,4.25; 32 -0.75,4.25; 33 -1.25,4.25; 34 -1.75,4.25; 35 -2.25,4.25; 36 -2.75,4.25 | smd 1.143 x 0.254: 13 4.25,-2.75; 14 4.25,-2.25; 15 4.25,-1.75; 16 4.25,-1.25; 17 4.25,-0.75; 18 4.25,-0.25; 19 4.25,0.25; 20 4.25,0.75; 21 4.25,1.25; 22 4.25,1.75; 23 4.25,2.25; 24 4.25,2.75; 37 -4.25,2.75; 38 -4.25,2.25; 39 -4.25,1.75; 40 -4.25,1.25; 41 -4.25,0.75; 42 -4.25,0.25; 43 -4.25,-0.25; 44 -4.25,-0.75; 45 -4.25,-1.25; 46 -4.25,-1.75; 47 -4.25,-2.25; 48 -4.25,-2.75
SC70 = smd 0.4 x 0.75: 1 -0.65,-0.825; 2 0,-0.825; 3 0.65,-0.825; 4 0.65,0.825; 5 -0.65,0.825
QFN-20-0.5MM = smd 0.28 x 1.05: 1 -1,-2.1; 2 -0.5,-2.1; 3 0,-2.1; 4 0.5,-2.1; 5 1,-2.1; 11 1,2.1; 12 0.5,2.1; 13 0,2.1; 14 -0.5,2.1; 15 -1,2.1 | smd 1.05 x 0.28: 6 2.1,-1; 7 2.1,-0.5; 8 2.1,0; 9 2.1,0.5; 10 2.1,1; 16 -2.1,1; 17 -2.1,0.5; 18 -2.1,0; 19 -2.1,-0.5; 20 -2.1,-1 | smd 2.7 x 2.7: PAD 0,0
MICRO-SD-SOCKET-PP = smd 0.8 x 1.5: 1 -8.94,10.7; 2 -7.84,10.3; 3 -6.74,10.7; 4 -5.64,10.9; 5 -4.54,10.7; 6 -3.44,10.9; 7 -2.34,10.7; 8 -1.24,10.7 | smd 1.8 x 1.4: CD1 -2.05,0.4; CD2 -7.75,0.4 | smd 1.4 x 1.9: GND1 -13.6,14.55; GND3 -0.45,13.55
RESONATOR-SMD = smd 0.7 x 1.7: 1 -1.2,0; 2 0,0; 3 1.2,0
CRYSTAL-SMD-5X3 = smd 1.9 x 1.1: 1 -1.85,-1.15; 2 1.85,-1.15; 3 1.85,1.15; 4 -1.85,1.15

### Placement (x,y rotation side)
C1  53.74,43.81 90 top
C2  21.59,35.56 90 top
C3  53.34,27.94 0 top
C4  60.33,38.73 180 top
C5  10.16,41.91 90 top
C6  12.7,41.91 270 top
C7  21.59,41.91 90 top
C8  24.13,41.91 270 top
C9  10.16,27.3 0 top
C10  10.16,26.03 0 top
C11  24.13,48.26 0 top
C12  24.13,55.88 180 top
C13  41.91,53.34 180 top
C14  44.45,48.26 0 top
C15  44.45,54.61 0 top
C16  44.45,50.16 0 top
C17  6.35,39.37 180 top
C18  26.67,49.53 270 top
C19  26.67,54.61 90 top
C20  41.91,52.07 0 top
C21  35.56,44.45 270 top
C22  34.29,23.49 180 top
C23  29.84,26.03 315 top
C24  39.37,26.35 45 top
C25  42.23,29.21 225 top
C26  28.57,16.51 90 top
C27  29.84,16.51 90 top
C28  40,16.51 90 top
C29  38.73,16.51 90 top
C30  28.57,12.7 90 top
C31  27.3,12.7 90 top
C32  40,12.7 90 top
C33  41.27,12.7 90 top
D1  7.62,44.77 90 top
JP1  12.67,55.88 45 top
JP2  52.07,16.51 45 top
JP3  17.14,49.53 45 top
JP4  43.18,25.4 225 top
JP5  58.42,58.42 225 top
JP6  38.73,46.35 315 top
JP7  26.67,3.81 0 top
JP8  41.91,64.77 0 top
L1  29.21,7.62 90 top
L2  26.67,7.62 90 top
L3  39.37,7.62 90 top
L4  41.91,7.62 90 top
LED1  15.24,44.45 270 top
LED2  26.67,44.45 270 top
LOGO1  33.53,32.89 0 top
LOGO2  43.88,46.42 0 bottom
LOGO3  45.72,43.34 315 top
R1  10.16,33.02 90 top
R1X  10.16,34.29 90 top
R2  57.78,41.27 90 top
R3  60.33,40 0 top
R4  26.67,52.07 270 top
R5  31.11,44.45 270 top
R6  32.38,58.42 180 top
R7  36.2,58.42 0 top
R8  15.24,43.18 0 top
R9  26.67,43.18 0 top
R10  41.91,54.61 180 top
R11  41.91,48.26 180 top
R12  41.91,50.16 180 top
R13  38.1,44.45 90 top
R14  36.83,44.45 90 top
R15  29.84,44.45 90 top
R16  39.37,44.45 90 top
R18  24.77,12.7 90 top
R19  26.03,12.7 90 top
R20  43.81,12.7 90 top
R21  42.55,12.7 270 top
R22  45.4,20.64 45 top
R24  44.45,36.83 180 top
R25  44.45,38.1 180 top
R26  44.45,39.37 180 top
S1  15.24,34.29 270 top
S2  34.29,34.29 45 top
SJ1  13.97,17.14 135 top
SJ2  17.14,13.97 135 top
SJ3  19.05,15.88 225 bottom
SJ4  53.34,55.88 45 bottom
SJ5  55.88,53.34 225 bottom
ST1  49.79,61.14 240 top
ST2  61.14,49.79 210 top
ST3  65.29,34.29 180 top
ST4  61.14,18.79 150 top
ST5  49.79,7.44 120 top
ST6  34.29,3.29 90 top
ST7  18.79,7.44 60 top
ST8  7.44,18.79 30 top
ST9  3.29,34.29 0 top
ST10  7.44,49.79 330 top
ST11  18.79,61.14 300 top
ST12  34.29,65.29 270 top
TP1  34.29,60.33 0 top
TP2  47.31,56.83 0 top
TP3  56.83,47.31 0 top
TP4  60.33,34.29 0 top
TP5  60.96,23.18 0 top
TP6  41.91,10.16 0 top
TP7  39.37,10.16 0 top
TP8  26.67,10.16 0 top
TP9  29.21,10.16 0 top
TP10  8.25,34.29 0 top
TP11  11.75,47.31 0 top
TP12  21.27,56.83 0 top
TP13  52.07,16.51 0 bottom
TP14  21.59,45.09 0 bottom
U1  53.34,34.29 270 top
U2  6.35,26.67 270 top
U3  6.35,41.91 270 top
U4  34.29,52.07 180 top
U5  18.41,41.91 270 top
U6  34.29,17.78 270 top
U7  22.05,31.94 135 top
U$1  34.29,12.35 0 top
U$4  34.29,34.29 0 bottom
U$12  1.27,-11.43 0 top  (outside the outline)
Y1  50.94,41.12 180 top
Y2  24.13,52.07 270 top

### Tracks (layer width: path | path; a pad name or v marks a point on that pad's centre or on a via)
1.8V  (via drill 0.6)
  Top 0.254: C8.1 24.13,44.45 29,49.32 U4.24 34.54,49.32 | 34.54,49.32 U4.31 34.54,46.12 C21.1 | 34.54,54.61 34.22,54.61 34.04,54.79 U4.7 | 34.54,49.32 34.54,54.61 | 34.54,54.61 34.84,54.61 35.04,54.81 U4.5
  Top 0.406: U5.5 19.7,42.56 20.45,43.31 C7.A | C7.A 22.73,43.31 23.48,42.56 C8.1 | C7.A TP14.P$1
  other vias: 21.59,45.09
3.3V  (via drill 0.51)
  Top 0.254: U5.3 16.84,41.26 16.19,41.91 | v35.56,52.32 U4.43 40.07,52.32 40.32,52.07 C20.1 | 35.56,49.82 U4.38 | v35.56,52.32 35.56,49.82 | 35.56,49.82 35.53,49.82 35.04,49.33 U4.32 | 31.41,54.95 30.48,55.88 30.48,59.74 31.75,60.96 32.86,60.96 33.66,61.75 34.92,61.75 35.72,60.96 35.72,58.66 35.56,58.5 35.56,58.44 R7.1 35.55,58.09 34.54,57.08 U4.6 | U4.45 36.56,53.32 v35.56,52.32 | 31.41,54.95 32.7,53.66 v32.7,51.82 U4.19 28.64,51.82 27,50.18 C18.1 | 52.14,37.15 U1.6 | 52.14,37.15 53.45,37.15 53.74,37.44 U1.4 C1.1 53.74,43.26 53.82,43.34 59.53,43.34 60.97,41.89 R3.2 | v17.14,19.06 U7.4 | 51.34,27.62 47.2,27.62 JP4.2 | 51.34,27.62 U1.18 51.34,30.89 50.16,32.07 50.16,35.17 52.14,37.15 | 51.34,27.62 52.37,27.62 C3.1 52.94,28.19 U1.20 | C19.1 26.91,53.96 27.27,54.32 U4.14 30.77,54.32 31.41,54.95 | R19.1 R18.1 24.77,12.06 24.13,12.06 v22.54,13.65 | R5.2 31.11,43.12 S2.5
  Top 0.406: 15.24,41.91 14.29,41.91 13.64,42.56 C6.1 12.05,42.56 11.3,43.31 C5.A 9.02,43.31 8.57,42.86 U3.5 7.65,44.19 D1.A | U5.1 16.84,42.56 16.19,41.91 15.89,41.91 | 15.24,41.91 15.89,41.91 | v15.24,40.64 15.24,41.91 | C1.1 53.74,43.1 53.66,43.02 44.29,43.02 v43.18,41.91 | 15.89,41.91 R8.2 | S1.4 12.77,37.15 v15.24,37.15
  Bottom 0.254: v17.14,19.06 18.41,19.06 22.54,14.92 v22.54,13.65
  Bottom 0.406: v15.24,40.64 26.42,51.82 v32.7,51.82 35.06,51.82 v35.56,52.32 | v17.14,19.06 v17.14,19.05 16.51,19.68 14.29,21.92 14.29,36.2 v15.24,37.15 v15.24,40.64 | v15.24,40.64 26.67,40.64 28.1,42.07 S2.5 33.28,43.18 41.91,43.18 v43.18,41.91
3.3V-TAP
  Top 0.406: TP10.1 8.57,34.61 12.1,34.61 S1.5
  Bottom 0.406: ST9.1 TP10.1
AMP-L  (via drill 0.51)
  Top 0.254: JP5.TSH 49.64,48.58 53.02,48.58 v54.61,50.16 | C28.1 v40,14.61
  Bottom 0.254: SJ4.1 53.34,55.24 53.34,53.97 54.61,52.7 v54.61,50.16 54.61,47.62 58.42,43.81 58.42,28.57 46.35,16.51 44.45,14.61 v40,14.61
AMP-LX
  Top 0.254: C26.2 28.57,17.78 29.56,18.78 U6.1
AMP-R  (via drill 0.51)
  Top 0.254: v51.12,53.02 52.39,54.29 v54.29,54.29 56.52,54.29 57.63,55.4 59.31,55.4 JP5.RSH | C26.1 v28.57,14.61
  Bottom 0.254: v51.12,53.02 52.7,51.44 52.7,47.62 57.15,43.18 57.15,29.21 44.45,16.51 30.48,16.51 v28.57,14.61 | v54.29,54.29 55.24,53.34 SJ5.1
AMP-RX
  Top 0.254: C28.2 40,17.78 39.02,18.78 U6.15
DTR  (via drill 0.6)
  Top 0.254: 51.12,17.46 46.99,13.34 46.34,12.68 45.7,12.05 R20.1 R21.2 | 51.12,17.46 60.96,27.3 60.96,32.86 61.75,33.66 61.75,34.92 60.96,35.72 60.96,38.72 C4.1 | TP13.P$1 51.12,17.46
  other vias: 52.07,16.51
EN-GPIO1  (via drill 0.51)
  Top 0.254: U1.25 57.63,28.74 55.24,26.35 48.89,26.35 43.18,20.64 41.27,20.64 36.51,25.4 34.29,25.4 | v28.26,47.31 28.26,46.35 28.26,41.91 24.61,38.26 24.61,34.77 26.67,32.7 31.11,32.7 34.29,29.53 34.29,25.4 | R13.2 38.1,45.72 v37.46,46.35 36.67,46.35 36.04,46.99 U4.34 | U6.18 34.29,25.4
  Bottom 0.254: v28.26,47.31 28.57,47.31 36.51,47.31 v37.46,46.35
FTDI-DTR
  Top 0.254: R20.2 43.81,14.61 44.13,14.92 44.13,15.47 JP2.1
FTDI-RXI
  Top 0.254: JP2.3 45.86,20.92 R22.2
G1
  Top 0.254: U4.12 31.54,57.15 31.75,57.15 | 32.04,57.15 U4.11 | 31.75,57.15 32.04,57.15 | 32.54,57.15 U4.10 | 32.54,57.15 33.02,57.15 33.04,57.15 U4.9 | 32.04,57.15 32.54,57.15 | 31.75,57.15 32.37,57.15 | 31.75,57.15 32.05,57.15 | R6.2 31.73,57.15 31.75,57.15
G2
  Top 0.254: U4.25 30.67,47.82 29.84,46.99 R15.2
GBUF  (via drill 0.51)
  Top 0.254: U4.42 39.62,51.82 40.32,51.12 41.26,51.12 | 41.26,51.12 46.67,51.12 47.43,50.36 48.14,50.36 50.16,52.39 50.16,55.04 v50.42,55.3 JP5.SLEEVE | 41.26,51.12 R12.2 | C27.1 v29.84,14.61 | C29.1 v38.73,14.61
  Bottom 0.254: v50.42,55.3 53.66,52.07 53.66,47.62 57.78,43.5 57.78,28.89 46.2,17.3 44.45,15.56 38.73,15.56 | 38.73,15.56 31.43,15.56 30.8,15.56 v29.84,14.61 | v38.73,14.61 38.73,15.56
GBUFLX
  Top 0.254: C27.2 29.84,17.78 30.33,18.28 U6.2
GBUFRX
  Top 0.254: C29.2 38.73,17.78 38.25,18.28 U6.14
GND  (via drill 0.51)  (1 unrouted)
  Top 0.254: U4.16 31.77,53.32 v31.75,53.18 | U4.22 28.73,50.32 27.94,49.53 | U4.21 29.23,50.82 | C16.2 45.09,50.18 45.09,50.16 v46.35,50.16 | 14.58,52.1 JP1.1 | 9.8,41.91 10.16,41.55 C5.C | U4.35 36.54,48.89 | 42.28,24.5 40.64,26.14 | 30.72,13.97 30.72,17.38 31.11,17.78 U6.3 U6.PAD | U6.PAD 36.2,19.68 | U6.PAD 32.38,19.68 | U6.PAD 32.38,15.88 | U6.PAD 36.2,15.88 | v34.29,10.48 U6.8 U6.PAD | U4.4 35.54,55.27 36.51,54.29 v36.83,54.61 37.33,54.32 U4.47 | U4.40 36.85,50.82 v36.83,50.8 37.35,51.32 U4.41 | U4.37 39.42,49.32 40,48.74 | U1.3 54.54,39.6 54.29,39.85 54.29,42.07 | U1.5 52.94,42.31
  Top 0.406: C17.2 5.7,38.75 6.35,38.1 R1X.P$2 | U2.2 6.03,26.67 6.35,26.99 6.35,29.21 8.25,31.11 9.21,32.07 9.21,33.09 9.79,33.67 R1.2 | JP3.1 14.58,52.1 | 9.8,41.91 U3.2 | 42.28,24.5 JP4.6 | C31.2 C30.2 | C33.2 C32.2
  Bottom 0.406: TP12.1 ST11.1
  other vias: 32.38,59.69 43.81,52.7 16.51,29.21 49.53,25.08 55.24,28.57 34.61,32.07 23.02,46.35 26.99,20 40.48,55.72 29.21,59.69 17.14,39.37 31.43,20 21.59,48.89 34.29,17.78 28.26,40.64 37.46,20 45.4,41.91 30.16,11.75 38.1,11.75 38.73,20 24.77,31.11 21.59,31.11 40.96,44.45 28.89,21.91 27.62,21.91 25.72,20 27.94,31.11 21.59,35.56 59.37,42.07 59.37,44.29 42.86,46.35 33.34,33.34 16.51,31.75 37.46,21.91 19.68,39.37 30.16,20
  pour Top: 34.29,0 arc90 68.58,34.29 arc90 34.29,68.58 arc90 0,34.29 arc90
  pour Bottom: 34.29,0 arc90 68.58,34.29 arc90 34.29,68.58 arc90 0,34.29 arc90
GPIO0
  Top 0.254: U4.33 35.54,46.69 36.83,45.4 36.81,45.1 R14.2
LEFT  (via drill 0.51)
  Top 0.254: JP5.TIP 47.71,53.89 v45.72,55.88 41.91,55.88 41.26,55.23 R10.2 40.64,54.61 v39.85,53.82 U4.46 | U1.22 54.54,30.71 53.18,32.07 52.7,32.07 v51.12,33.66
  Bottom 0.254: SJ4.2 52.07,57.15 50.8,57.15 48.89,55.24 46.35,55.24 v45.72,55.88 | v39.85,53.82 50.16,43.5 50.16,34.61 v51.12,33.66
MISO  (via drill 0.51)
  Top 0.254: U7.7 16.14,22.81 v18.73,25.4 | U4.30 34.04,45.81 34.61,45.24 34.61,43.27 35.24,42.64 35.24,35.08 36.35,33.97 39.21,33.97 v40.16,33.02 | v40.16,33.02 | 45.09,31.49 44.08,31.49 42.55,33.02 v40.16,33.02 | 45.09,31.49 U1.16 | JP4.1 45.09,29.1 45.09,31.49
  Bottom 0.254: v18.73,25.4 19.05,25.72 33.97,25.72 40.16,31.91 v40.16,33.02
MOSI  (via drill 0.51)
  Top 0.254: U7.3 19.25,19.88 v21.59,22.23 | v38.73,33.02 36.35,33.02 34.61,34.77 34.61,42.35 33.97,42.99 33.97,45.09 33.54,45.52 U4.29 | U1.15 44.23,32.29 42.55,33.97 v41.27,33.97
  Bottom 0.254: JP4.4 44.08,22.17 42.86,20.95 41.59,20.95 38.1,24.45 23.81,24.45 v21.59,22.23 20,22.23 17.78,24.45 17.78,25.72 18.41,26.35 33.66,26.35 38.73,31.43 v38.73,33.02 39.69,33.97 v41.27,33.97
MP3-CS  (via drill 0.51)
  Top 0.254: U4.23 31.09,49.82 v31.75,50.48 | U1.10 50.26,36.29 50.48,36.51 50.48,37.15 46.99,40.64 v44.45,40.64
  Bottom 0.254: v31.75,50.48 29.84,50.48 27.3,47.94 27.3,46.67 29.21,44.77 38.1,44.77 39.05,45.72 41.59,45.72 44.45,42.86 v44.45,40.64
MP3-DCS  (via drill 0.51)
  Top 0.254: U4.13 29.32,54.82 28.89,55.24 v28.89,56.2 | U1.11 47.38,35.49 v46.35,36.51
  Bottom 0.254: v28.89,56.2 33.97,56.2 37.78,52.39 37.78,49.53 39.37,47.94 42.86,47.94 47.31,43.49 47.31,37.47 v46.35,36.51
MP3-DREQ  (via drill 0.51)
  Top 0.254: U4.8 33.54,57.19 34.29,57.94 v34.29,58.42 | U1.32 56.77,37.09 v55.88,36.2
  Bottom 0.254: v34.29,58.42 40.96,58.42 56.52,42.86 56.52,36.83 v55.88,36.2
MP3-MIDI-RX  (via drill 0.51)
  Top 0.254: U4.26 32.04,46.59 v31.75,46.3 31.11,45.67 R5.1
  Bottom 0.254: v31.75,46.3 32.65,45.4 33.02,45.4 37.78,45.4 38.42,46.04 38.42,46.99 35.56,49.85 35.56,50.96 36.54,51.94 36.54,52.68 34.61,54.61 25.4,54.61 20.32,49.53 20.32,47.94 13.65,41.27 13.65,36.51 13.65,20.64 15.24,19.05 18.41,15.88 SJ3.1
MP3-RST  (via drill 0.51)
  Top 0.254: v38.42,56.83 38.42,57.78 37.78,58.42 R7.2 36.84,57.96 36.04,57.15 U4.3 | U1.12 46.59,34.69 v46.35,34.92
  Bottom 0.254: v38.42,56.83 38.42,50.16 39.69,48.89 42.86,48.89 48.26,43.5 48.26,36.83 v46.35,34.92
N$1
  Top 0.254: U1.7 51.34,39.27 52.14,40.08 Y1.1
N$3
  Top 0.254: U1.8 50.54,39.31 49.74,40.11 Y1.3
N$4
  Top 0.254: U4.44 40.12,52.82 40.64,53.34 C13.2
N$5
  Top 0.254: C16.1 R12.1
N$6
  Top 0.254: R8.1 14.59,44.35 LED1.A
N$7
  Top 0.254: C15.1 R10.1
N$8
  Top 0.254: R9.2 27.32,44.35 LED2.C
N$9
  Top 0.254: U4.18 27.87,52.32 26.97,51.42 R4.2 26.02,51.42 25.4,50.8 25.4,50.34 Y2.3 25.28,48.76 C11.2
N$10
  Top 0.254: U4.17 26.98,52.82 26.88,52.72 R4.1 26.49,52.72 26.1,52.32 24.19,52.32 22.86,53.66 22.86,53.8 Y2.1 22.98,55.38 C12.2
N$11
  Top 0.254: C14.1 R11.1
N$12  (via drill 0.51)
  Top 0.254: v42.55,36.83 R24.2
  Bottom 0.254: v42.55,36.83 39.05,40.32 37.15,40.32 33.24,36.41 S2.1
N$13  (via drill 0.51)
  Top 0.254: v42.55,38.1 R25.2
  Bottom 0.254: v42.55,38.1 39.69,40.96 36.51,40.96 33.38,37.83 S2.2
N$14  (via drill 0.51)
  Top 0.254: v42.55,39.37 R26.2
  Bottom 0.254: v42.55,39.37 40.32,41.59 35.88,41.59 33.67,39.38 32.02,39.38 S2.4
N$16
  Top 0.254: 32.97,12.65 33.29,12.97 U6.6
  Top 0.406: 32.97,12.65 30.8,10.48 30.8,6.03 30.48,5.71 29.53,5.71 29.21,6.03 L1.1
N$17
  Top 0.254: U6.7 33.79,12.36 33.47,12.04
  Top 0.406: 33.47,12.04 31.59,10.16 31.59,5.71 30.8,4.92 27.78,4.92 26.67,6.03 L2.1
N$18
  Top 0.254: U6.10 35.29,12.97 35.61,12.65
  Top 0.406: 35.61,12.65 37.78,10.48 37.78,6.03 38.1,5.71 39.05,5.71 39.37,6.03 L3.1
N$19
  Top 0.254: U6.9 34.79,12.36 35.11,12.04
  Top 0.406: 35.11,12.04 36.99,10.16 36.99,5.71 37.78,4.92 40.8,4.92 41.91,6.03 L4.1
N$70
  Top 0.406: U3.4 7.65,40.02 C17.1
N$73
  Top 0.254: U4.36 37.91,47.82 39.37,46.35 R16.2
PROG
  Top 0.254: R1.1 R1X.P$1
  Top 0.406: U2.5 7.65,28.61 9.52,30.48 R1X.P$1
RIGHT  (via drill 0.51)
  Top 0.254: 41.26,49.21 R11.2 | 41.26,49.21 51.75,49.21 53.97,51.44 v55.88,51.44 56.31,51.44 JP5.RING | U1.19 52.14,31.36 v51.12,32.38 | U4.39 v39.85,50.32 39.85,49.69 40,49.53 40.32,49.21 41.26,49.21
  Bottom 0.254: SJ5.2 55.88,52.7 v55.88,51.44 | v51.12,32.38 49.21,34.29 49.21,43.5 42.39,50.32 v39.85,50.32
ROT-A  (via drill 0.51)
  Top 0.254: C24.1 38.91,26.13 S2.A | U1.1 56.14,40.06 v55.56,40.64
  Bottom 0.254: S2.A 40.24,27.22 43.34,30.16 54.77,30.16 55.88,31.27 55.88,33.5 54.93,34.45 54.93,40 v55.56,40.64
ROT-B  (via drill 0.51)
  Top 0.254: C25.1 42.45,29.67 S2.B | U1.26 57.62,32.31 v55.01,32.31
  Bottom 0.254: S2.B 53.46,30.75 v55.01,32.31
ROT-LEDB
  Top 0.254: U1.9 48.63,37.09 46.35,39.37 R26.1
ROT-LEDG  (via drill 0.51)
  Top 0.254: U1.24 56.14,28.2 54.93,26.99 48.58,26.99 42.86,21.27 41.59,21.27 34.92,27.94 34.92,29.84 31.59,33.18 31.59,38.89 v33.02,40.32 | v46.35,38.1 R25.1
  Bottom 0.254: v33.02,40.32 34.92,42.23 40.96,42.23 45.09,38.1 v46.35,38.1
ROT-LEDR
  Top 0.254: U1.14 44.38,33.09 42.86,34.61 42.86,35.24 43.5,35.88 44.77,35.88 45.1,36.21 R24.1
ROT-SW  (via drill 0.51)
  Top 0.254: R2.2 57.77,41.91 v55.56,41.91 54.77,41.12 54.77,40.16 55.34,39.59 U1.2
  Bottom 0.254: S2.3 26.54,39.24 24.61,37.31 24.61,35.4 25.72,34.29 34.61,34.29 36.2,35.88 44.13,35.88 48.58,31.43 53.02,31.43 53.97,32.38 53.97,40.32 v55.56,41.91
RST  (via drill 0.51)
  Top 0.254: R3.1 C4.2 57.78,38.73 56.52,37.46 55.56,37.46 54.93,36.83 54.93,35.88 v55.88,34.92 56.11,34.69 U1.29
  Bottom 0.254: JP4.5 42.28,24.5 47.31,29.53 54.93,29.53 56.52,31.11 56.52,34.29 v55.88,34.92
SCK  (via drill 0.51)
  Top 0.254: U7.5 17.69,21.19 v20.32,23.81 | U1.17 50.54,28.99 49.8,28.26 46.04,28.26 44.08,26.3 JP4.3 42.28,28.15 43.81,29.69 43.81,30.8 42.55,32.07 36.35,32.07 33.97,34.45 33.97,42.07 33.34,42.7 33.34,44.93 33.04,45.22 U4.28
  Bottom 0.254: JP4.3 39.63,26.3 38.42,25.08 21.59,25.08 v20.32,23.81
SD-CS  (via drill 0.51)
  Top 0.254: U7.2 20.38,19.11 v22.54,21.27 | U1.13 44.85,33.89 v43.81,34.92
  Bottom 0.254: v22.54,21.27 19.68,21.27 16.77,24.18 16.77,25.98 17.78,26.99 33.34,26.99 37.78,31.43 37.78,33.34 39.37,34.92 v43.81,34.92
SPKL+
  Top 0.406: L3.2 TP7.1 39.37,10.48 40,11.11 C32.1
  Bottom 0.406: TP7.1 35.56,10.16 34.29,8.89 ST6.1
SPKL-
  Top 0.406: C33.1 41.27,11.11 41.91,10.48 TP6.1 L4.2
  Bottom 0.406: ST5.1 49.62,7.62 44.45,7.62 TP6.1
SPKR+
  Top 0.406: L1.2 TP9.1 29.21,10.48 28.57,11.11 C30.1
  Bottom 0.406: TP9.1 27.62,11.75 21.27,11.75 11.75,21.27 ST8.1
SPKR-
  Top 0.406: L2.2 TP8.1 26.67,10.48 27.3,11.11 C31.1
  Bottom 0.406: ST7.1 18.96,7.62 24.13,7.62 TP8.1
STAT
  Top 0.254: U2.1 4.12,27.62 3.81,27.3 3.81,24.45 5.08,23.18 12.06,23.18 20.95,32.07 23.18,32.07 23.97,32.86 23.97,38.58 26.02,40.62 R9.1
TRIG1  (via drill 0.51)
  Top 0.254: U1.23 55.34,30.7 v53.02,33.02
  Bottom 0.254: v53.02,33.02 51.12,34.92 51.12,43.81 39.37,55.56 39.37,57.15 38.73,57.78 34.92,57.78 34.61,57.47 33.97,57.47 33.34,58.1 33.34,59.37 TP1.1 ST12.1
TRIG2/SDA  (via drill 0.51)
  Top 0.254: U1.27 55.49,33.09 55.24,33.34 54.61,33.34 v53.02,34.92 | v36.67,34.92 37.62,35.88 39.69,35.88 40.64,36.83 40.64,42.55 42.86,44.77 47.94,44.77 v50.48,47.31 | U6.19 33.79,20.66 33.5,20.95 29.84,20.95 25.4,20.95 24.77,20.32 24.77,15.88 24.77,14.61 | v20,28.89 24.13,24.77 24.13,17.14 22.23,15.24 18.41,15.24 17.78,15.24 SJ2.2 SJ2.1 18.42,14.61 20.32,14.61 23.49,14.61 24.77,14.61 | v40.64,57.15 46.99,57.15 TP2.1 | R18.2 24.77,14.61
  Bottom 0.254: v53.02,34.92 52.07,35.88 52.07,44.29 50.48,45.88 v50.48,47.31 v40.64,57.15 | TP2.1 ST1.1 | v20,28.89 20.64,28.26 32.7,28.26 36.2,31.75 36.2,34.45 v36.67,34.92
TRIG3/SCL  (via drill 0.51)
  Top 0.254: U1.28 55.33,33.89 v53.02,36.2 | v38.1,34.92 40,34.92 41.27,36.2 41.27,42.39 43.02,44.13 50.48,44.13 v52.07,45.72 53.66,47.31 TP3.1 | U6.17 34.79,21.14 v35.56,21.91 | v23.18,17.46 21.59,15.88 17.46,15.88 15.72,17.62 15.08,17.62 SJ1.1 SJ1.2 14.45,18.26 16.03,18.26 17.78,16.51 20.8,16.51 23.49,19.21 23.49,23.49 v19.05,27.94 | R19.2 v26.03,14.61
  Bottom 0.254: TP3.1 ST2.1 | v53.02,36.2 53.02,44.77 v52.07,45.72 | v38.1,34.92 36.99,33.81 36.99,31.59 33.02,27.62 19.37,27.62 v19.05,27.94 | v35.56,21.91 34.61,22.86 27.15,22.86 23.18,18.89 v23.18,17.46 v26.03,14.61
TRIG4/TXO  (via drill 0.51)
  Top 0.254: U1.31 59.59,36.29 60.33,35.56 TP4.1 60.33,27.62 48.58,15.88 47.94,15.24 | 47.94,15.24 46.35,13.65 v45.4,13.65 | JP2.2 47.94,15.25 47.94,15.24
  Bottom 0.254: TP4.1 ST3.1 | SJ3.2 19.05,15.24 21.59,12.7 44.13,12.7 44.45,12.7 v45.4,13.65
TRIG5/RXI  (via drill 0.51)
  Top 0.254: U1.30 58.65,35.49 58.9,35.25 58.9,33.66 59.69,32.86 59.69,27.94 56.2,24.45 v55.56,24.45 55.56,23.81 48.89,17.14 47.98,17.14 R22.1
  Bottom 0.254: TP5.1 60.96,18.96 ST4.1 55.56,22.23 v55.56,24.45
VBATT  (via drill 0.51)
  Top 0.406: JP1.2 16.3,53.97 JP3.2 | U2.3 5.05,24.8 5.71,24.13 v8.89,24.13 9.51,24.75 C10.1 | v12.7,38.73 16.12,38.73 S1.1
  Bottom 0.406: JP3.2 18.94,48.47 12.7,42.23 v12.7,38.73 12.7,28.57 12.7,25.72 11.11,24.13 v8.89,24.13
VBATT_SW  (via drill 0.51)
  Top 0.254: U6.4 31.59,17.28 31.59,16.78 | U6.5 31.59,16.78 | U6.11 37.15,16.78 | U6.13 37.31,17.78 37.78,17.3 37.78,14.84 v37.46,14.61 37.15,14.84 37.15,16.78 | 31.59,16.78 v31.59,14.61 | U6.12 37.15,17.28 37.15,16.78 | C23.1 30.04,27.15 30.32,27.15
  Top 0.406: U3.1 3.81,42.86 | 3.81,42.86 3.81,42.55 3.81,40.96 | 3.81,40.96 3.81,39.05 5.71,37.15 7.94,37.15 9.52,35.56 13.97,35.56 15.24,34.29 v16.51,34.29 S1.2 20.98,37.21 C2.A | U3.3 3.81,40.96 | v33.02,21.91 33.02,23.36 C22.A 32.89,24.58 30.32,27.15 v28.26,29.21 | D1.C 4.68,45.32 3.81,44.45 3.81,43.17 3.81,42.86
  Bottom 0.406: v37.46,14.61 v31.59,14.61 30.32,13.34 28.26,13.34 27.46,14.13 27.46,18.89 30.48,21.91 v33.02,21.91 | v16.51,34.29 21.59,29.21 v28.26,29.21
VIN  (via drill 0.51)
  Top 0.254: LED2.A 25.08,43.61 25.08,40.64 23.34,38.89 23.34,33.18 22.86,32.7 20.64,32.7 18.1,30.16 16.03,30.16 15.24,29.37 v15.24,28.57 | 7.94,25.72 U2.4
  Top 0.406: JP2.4 v47.67,22.7 | 7.94,25.72 8.57,26.35 8.57,26.99 8.89,27.3 C9.1 9.51,28.24 9.84,28.57 v11.75,28.57 v15.24,28.57
  Bottom 0.406: v15.24,28.57 15.24,24.13 19.37,20 23.18,20 26.83,23.65 37.78,23.65 41.27,20.16 45.13,20.16 v47.67,22.7 | v11.75,28.57 TP11.1 ST10.1

### Text on the board
Bottom: V15
tPlace: T1 | GND | SDA | T2 | 3.5-6V | + | VIN | - | Power | Charge | T3 | SCL | ON | T4 | TXO | R1 | 3.3V | OFF | BLK | ISP | T5 | RXI | + | SJ1 | SPEAKER | RIGHT | SJ2 | - | GRN | 5V FTDI | MP3 | - | LEFT | + | SPEAKER
bPlace: T1 | GND | SDA | T2 | SJ4 | 3.7-6V | SJ5 | VIN | VBATT | GND | T3 | SCL | LilyPad MP3 | 1.8V | 3.3V | T4 | TXO | SJ3 | T5 | + | DTR | RXI | -L+ | +R- | RIGHT | - | SPEAKER | - | LEFT | SPEAKER | +
tValues: N. Seidle, M. Grusin